# EAGLE schematic display-schematics (EAGLE 6.5.0)

## Sheet 1 of 2
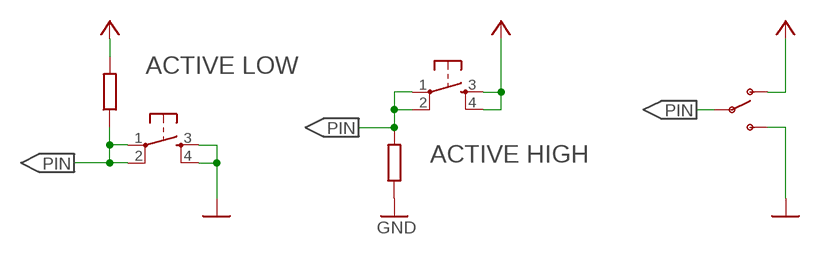
[diagram p0: schematic, sheet 1]

### Parts
R1  R-EU_0411/15  [0411/15]
R2  R-EU_0411/15  [0411/15]
S1  SWITCH-SPDTSMD2  [SWITCH-SPDT-SMD]
S2  TAC_SWITCHPTH  [TACTILE-PTH]
S3  TAC_SWITCHPTH  [TACTILE-PTH]

### Nets
GND: R2.1 S1.3(S) S2.3 S2.4 ; also sheet 2
N$1: R1.1 S2.1 S2.2
N$2: R2.2 S3.1 S3.2
N$3: S1.2(P)
VCC: R1.2 S1.1(O) S3.3 S3.4

### Notes on the sheet
- ACTIVE LOW
- PIN
- PIN
- ACTIVE HIGH
- PIN

## Sheet 2 of 2
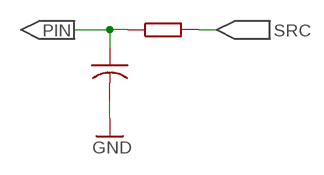
[diagram p1: schematic, sheet 2]

### Parts
C1  C-US025-040X050  [C025-040X050]
R3  R-EU_0411/15  [0411/15]

### Nets
GND: C1.2 ; also sheet 1
N$4: C1.1 R3.1
N$5: R3.2

### Notes on the sheet
- PIN | SRC

## Library data of the parts
C1 = adafruit:C-US: CAPACITOR, American symbol
R1-R3 = resistor:R-EU_: RESISTOR, European symbol
S1 = SparkFun-Electromechanical:SWITCH-SPDT: SPDT Switch Simple slide switch, Spark Fun Electronics SKU : COM-00102 DPDT SMT slide switch, AYZ0202, SWCH-08179
S2 S3 = SparkFun-Electromechanical:TAC_SWITCH: Momentary Switch Button commonly used for reset or general input. Spark Fun Electronics SKU : COM-00097 SMT- SWCH-08247